# Altium schematic sheet CPU - Storage.SchDoc: Title
size Tabloid; Revision: A; ProjectTitle: CDU: CAN Display Unit
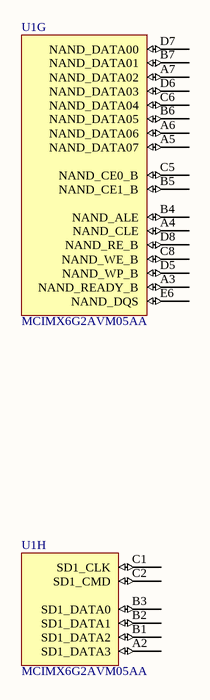
[diagram p0: CPU - Storage.SchDoc]

## Parts
U1  MCIMX6G2AVM05AA  [BGA289C80P17X17_1400X1400X132]  (parts G,H of 14)

## Nets

Not connected (* = marked no-connect by the designer): U1 A2(SD1_DATA3) A3(NAND_READY_B) A4(NAND_CLE) A5(NAND_DATA07) A6(NAND_DATA06) A7(NAND_DATA02) B1(SD1_DATA2) B2(SD1_DATA1) B3(SD1_DATA0) B4(NAND_ALE) B5(NAND_CE1_B) B6(NAND_DATA05) B7(NAND_DATA01) C1(SD1_CLK) C2(SD1_CMD) C5(NAND_CE0_B) C6(NAND_DATA04) C8(NAND_WE_B) D5(NAND_WP_B) D6(NAND_DATA03) D7(NAND_DATA00) D8(NAND_RE_B) E6(NAND_DQS)

## Notes on the sheet
- Date:
- Revision:
- Sheet:
- /